# Altium project drone_base.PrjPcb
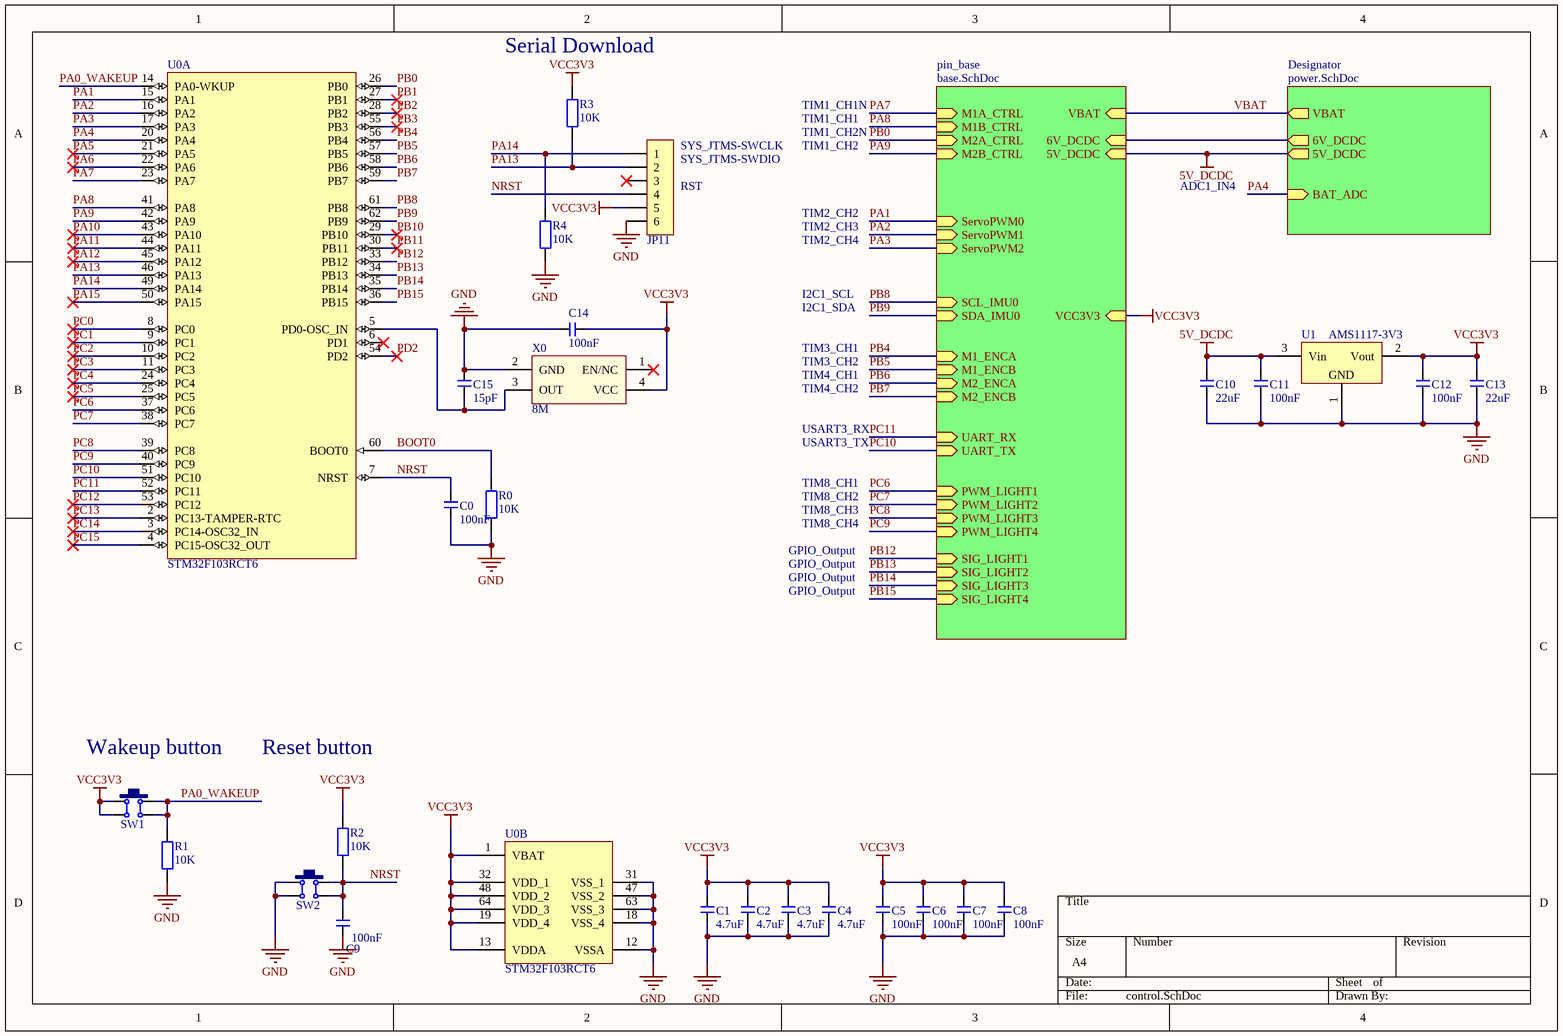
[diagram p0: control.SchDoc]
3 sheets, 91 parts. Net scope: hierarchical (ports join the sheet entries above them; power ports are global).
Board file: PCB.PcbDoc
Sheets:
  control.SchDoc
    pin_base = base.SchDoc
    Designator = power.SchDoc

## Sheet control.SchDoc
size A4; SheetNumber: 1; SheetTotal: 3

### Parts
C0  100nF  [C 0402_M]
C1  4.7uF  [C 0603_M]
C2  4.7uF  [C 0603_M]
C3  4.7uF  [C 0603_M]
C4  4.7uF  [C 0603_M]
C5  100nF  [C 0402_M]
C6  100nF  [C 0402_M]
C7  100nF  [C 0402_M]
C8  100nF  [C 0402_M]
C9  100nF  [C 0402_M]
C10  22uF  [C 1206_M]
C11  100nF  [C 0402_M]
C12  100nF  [C 0402_M]
C13  22uF  [C 1206_M]
C14  100nF  [C 0402_M]
C15  15pF  [C 0402_M]
JP11  HDR-1X6  [HDR2.54-WI-6P]  (value not drawn)
R0  10K  [R 0402_M]
R1  10K  [R 0402_M]
R2  10K  [R 0402_M]
R3  10K  [R 0402_M]
R4  10K  [R 0402_M]
SW1  6x6x5  [TSW SMD-6*6*4.3]  (value not drawn)
SW2  6x6x5  [TSW SMD-6*6*4.3]  (value not drawn)
U0  STM32F103RCT6  [LQFP64_M]  (parts A,B of 2)
U1  AMS1117-3V3  [SOT223_L]
X0  8M  [OSC 3225-4P]

### Sub-sheets
Designator = power.SchDoc: VBAT (out), 6V_DCDC (out), 5V_DCDC (out), BAT_ADC (in)
pin_base = base.SchDoc: M2B_CTRL (in), M2A_CTRL (in), M1B_CTRL (in), M1A_CTRL (in), VBAT (in), ServoPWM0 (in), ServoPWM1 (in), ServoPWM2 (in), SCL_IMU0 (in), SDA_IMU0 (in), M1_ENCB (in), M1_ENCA (in), M2_ENCA (in), M2_ENCB (in), 6V_DCDC (in), VCC3V3 (in), 5V_DCDC (in), UART_RX (in), UART_TX (in), PWM_LIGHT1 (in), PWM_LIGHT2 (in), PWM_LIGHT3 (in), PWM_LIGHT4 (in), SIG_LIGHT1 (in), SIG_LIGHT2 (in), SIG_LIGHT3 (in), SIG_LIGHT4 (in)

### Nets
5V_DCDC: C10.2 C11.2 U1.3(Vin) ; sheet pin_base/5V_DCDC, sheet Designator/5V_DCDC
6V_DCDC: sheet pin_base/6V_DCDC, sheet Designator/6V_DCDC
GND: C0.1 C1.1 C2.1 C3.1 C4.1 C5.1 C6.1 C7.1 C8.1 C9.1 C10.1 C11.1 C12.1 C13.1 C14.2 C15.1 JP11.6 R0.1 R1.1 R4.1 SW2.1 SW2.4 U0.12(VSSA) U0.18(VSS_4) U0.31(VSS_1) U0.47(VSS_2) U0.63(VSS_3) U1.1(GND) X0.2(GND)
VBAT: sheet pin_base/VBAT, sheet Designator/VBAT
VCC3V3: C1.2 C2.2 C3.2 C4.2 C5.2 C6.2 C7.2 C8.2 C12.2 C13.2 C14.1 JP11.5 R2.2 R3.2 SW1.1 SW1.4 U0.1(VBAT) U0.13(VDDA) U0.19(VDD_4) U0.32(VDD_1) U0.48(VDD_2) U0.64(VDD_3) U1.2(Vout) X0.4(VCC) ; sheet pin_base/VCC3V3
BOOT0: R0.2 U0.60(BOOT0)
NRST: C0.2 C9.2 JP11.4 R2.1 SW2.2 SW2.3 U0.7(NRST)
PA0_WAKEUP: R1.2 SW1.2 SW1.3 U0.14(PA0-WKUP)
PA1: U0.15(PA1) ; sheet pin_base/ServoPWM0
PA2: U0.16(PA2) ; sheet pin_base/ServoPWM1
PA3: U0.17(PA3) ; sheet pin_base/ServoPWM2
PA4: U0.20(PA4) ; sheet Designator/BAT_ADC
PA5: U0.21(PA5)
PA6: U0.22(PA6)
PA7: U0.23(PA7) ; sheet pin_base/M1A_CTRL  [project net M1B_CTRL]
PA8: U0.41(PA8) ; sheet pin_base/M1B_CTRL  [project net M1A_CTRL]
PA9: U0.42(PA9) ; sheet pin_base/M2B_CTRL  [project net M2B_CTRL]
PA10: U0.43(PA10)
PA11: U0.44(PA11)
PA12: U0.45(PA12)
PA13: JP11.2 R3.1 U0.46(PA13)
PA14: JP11.1 R4.2 U0.49(PA14)
PA15: U0.50(PA15)
PB0: U0.26(PB0) ; sheet pin_base/M2A_CTRL  [project net M2A_CTRL]
PB1: U0.27(PB1)
PB2: U0.28(PB2)
PB3: U0.55(PB3)
PB4: U0.56(PB4) ; sheet pin_base/M1_ENCA
PB5: U0.57(PB5) ; sheet pin_base/M1_ENCB
PB6: U0.58(PB6) ; sheet pin_base/M2_ENCA
PB7: U0.59(PB7) ; sheet pin_base/M2_ENCB
PB8: U0.61(PB8) ; sheet pin_base/SCL_IMU0
PB9: U0.62(PB9) ; sheet pin_base/SDA_IMU0
PB10: U0.29(PB10)
PB11: U0.30(PB11)
PB12: U0.33(PB12) ; sheet pin_base/SIG_LIGHT1
PB13: U0.34(PB13) ; sheet pin_base/SIG_LIGHT2
PB14: U0.35(PB14) ; sheet pin_base/SIG_LIGHT3
PB15: U0.36(PB15) ; sheet pin_base/SIG_LIGHT4
PC0: U0.8(PC0)
PC1: U0.9(PC1)
PC2: U0.10(PC2)
PC3: U0.11(PC3)
PC4: U0.24(PC4)
PC5: U0.25(PC5)
PC6: U0.37(PC6) ; sheet pin_base/PWM_LIGHT1
PC7: U0.38(PC7) ; sheet pin_base/PWM_LIGHT2
PC8: U0.39(PC8) ; sheet pin_base/PWM_LIGHT3
PC9: U0.40(PC9) ; sheet pin_base/PWM_LIGHT4
PC10: U0.51(PC10) ; sheet pin_base/UART_TX
PC11: U0.52(PC11) ; sheet pin_base/UART_RX
PC12: U0.53(PC12)
PC13: U0.2(PC13-TAMPER-RTC)
PC14: U0.3(PC14-OSC32_IN)
PC15: U0.4(PC15-OSC32_OUT)
PD2: U0.54(PD2)
NetC15_2: C15.2 U0.5(PD0-OSC_IN) X0.3(OUT)

Not connected (* = marked no-connect by the designer): JP11 3*; U0 6(PD1)*; X0 1(EN/NC)*

### Notes on the sheet
- (near R3) Serial Download
- TIM1_CH1N
- (near JP11) SYS_JTMS-SWDIO
- (near JP11) SYS_JTMS-SWCLK
- TIM1_CH1
- TIM1_CH2N
- TIM1_CH2
- (near JP11) RST
- TIM2_CH2
- TIM2_CH3
- TIM2_CH4
- ADC1_IN4
- I2C1_SCL
- I2C1_SDA
- TIM3_CH1
- TIM3_CH2
- TIM4_CH1
- TIM4_CH2
- USART3_RX
- USART3_TX
- TIM8_CH1
- TIM8_CH2
- TIM8_CH3
- GPIO_Output
- TIM8_CH4
- (near SW1) Wakeup button
- Reset button

### Library data of the parts
C0-C15 = C: 贴片电容
JP11 = Header 6: 6P接插件; 版权归属: 封装库来自淘宝 ID：黄晶宝石; BOM名称: 6P接插件; 学习资源: https://shop463601444.taobao.com
R0-R4 = R: 贴片电阻
SW1 SW2 = TSW SMD-6x6: 贴片6x6轻触开关
U0 = STM32F103RCT6: STM32 ARM-based 32-bit MCU Performance Line with 256 kB Flash, 48 kB Internal RAM, -40 to +85癈 Temperature, 64-Pin LQFP, Tray; DatasheetVersion: rev8.0, Apr-2011; PackageVersion: rev13, Apr-2011; PackageReference: LQFP64; PackageDescription: 64-Pin Low-Profile Quad Flat Pack, 10 x 10 mm Body, 0.5 mm Pitch (LQFP64); ComponentLink1Description: Manufacturer URL; ComponentLink1URL: http://www.st.com/; ComponentLink2Description: STM32F103 Datasheet; ComponentLink2URL: http://www.st.com/internet/com/TECHNICAL_RESOURCES/TECHNICAL_LITERATURE/DATASHEET/CD00191185.pdf; ComponentLink3Description: STM32 Family Web Page; ComponentLink3URL: www.st.com/stm32
U1 = AMS1117: 三端稳压芯片; BOM名称: 稳压芯片; 淘宝ID: 封装库来自淘宝 ID：黄晶宝石; 欢迎光临淘宝店铺: https://shop463601444.taobao.com
X0 = XTAL-ACT-4P: 4脚有源晶振

## Sheet base.SchDoc
size A4; SheetNumber: 2; SheetTotal: 3
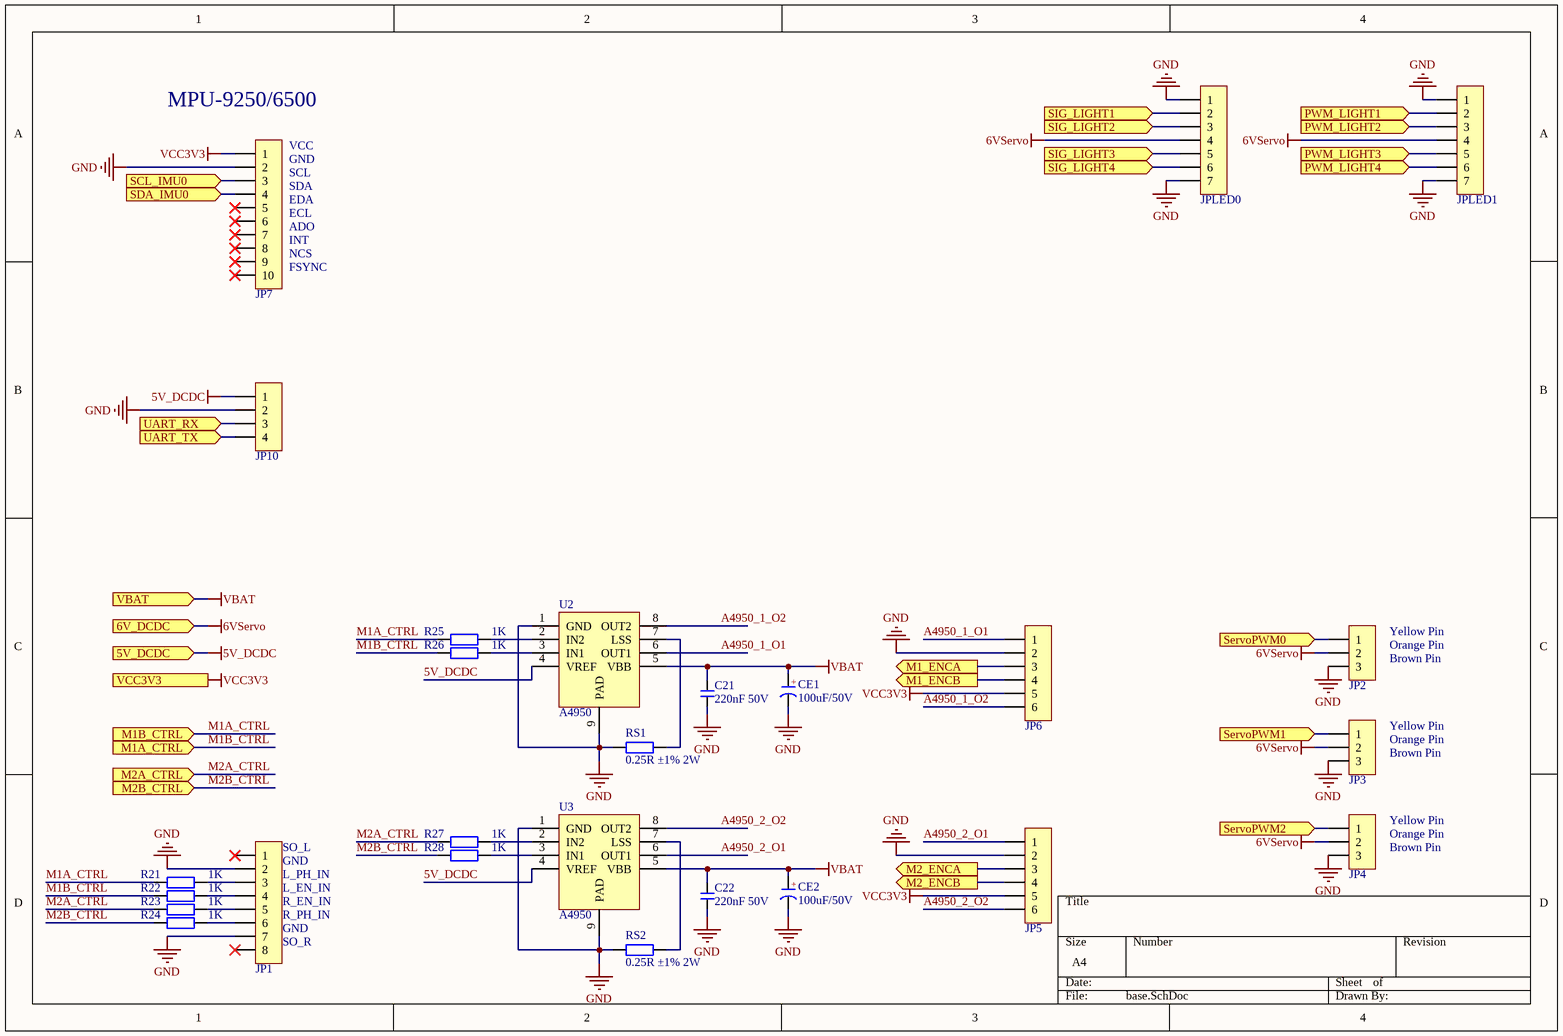
[diagram p1: base.SchDoc]

### Parts
C21  220nF 50V  [C 0603_M]
C22  220nF 50V  [C 0603_M]
CE1  100uF/50V  [CM E(8*10.2)]
CE2  100uF/50V  [CM E(8*10.2)]
JP1  HDR-1X8  [MX 1.25-LI-8P]  (value not drawn)
JP2  HDR-1X3  [HDR2.54-LI-3P]  (value not drawn)
JP3  HDR-1X3  [HDR2.54-LI-3P]  (value not drawn)
JP4  HDR-1X3  [HDR2.54-LI-3P]  (value not drawn)
JP5  HDR-1X6  [XH2.54-LI-6P]  (value not drawn)
JP6  HDR-1X6  [XH2.54-LI-6P]  (value not drawn)
JP7  HDR-1X10  [HDR2.54-M-LI-10P]  (value not drawn)
JP10  HDR-1X4  [HDR2.54-LI-4P]  (value not drawn)
JPLED0  HDR-1X7  [XH2.54-LI-7P]  (value not drawn)
JPLED1  HDR-1X7  [XH2.54-LI-7P]  (value not drawn)
R21  1K  [R 0402_M]
R22  1K  [R 0402_M]
R23  1K  [R 0402_M]
R24  1K  [R 0402_M]
R25  1K  [R 0402_M]
R26  1K  [R 0402_M]
R27  1K  [R 0402_M]
R28  1K  [R 0402_M]
RS1  0.25R ±1% 2W  [R 2512_M]
RS2  0.25R ±1% 2W  [R 2512_M]
U2  A4950  [A4950]
U3  A4950  [A4950]

### Ports
5V_DCDC (in), 6V_DCDC (in), M1_ENCA (out), M1_ENCB (out), M1A_CTRL (in), M1B_CTRL (in), M2_ENCA (out), M2_ENCB (out), M2A_CTRL (in), M2B_CTRL (in), PWM_LIGHT1 (in), PWM_LIGHT2 (in), PWM_LIGHT3 (in), PWM_LIGHT4 (in), SCL_IMU0 (in), SDA_IMU0 (in), ServoPWM0 (in), ServoPWM1 (in), ServoPWM2 (in), SIG_LIGHT1 (in), SIG_LIGHT2 (in), SIG_LIGHT3 (in), SIG_LIGHT4 (in), UART_RX (in), UART_TX (in), VBAT (in), VCC3V3 (in)

### Nets
5V_DCDC: JP10.1 U2.4(VREF) U3.4(VREF) ; port 5V_DCDC
6VServo: JP2.2 JP3.2 JP4.2 JPLED0.4 JPLED1.4 ; port 6V_DCDC  [project net 6V_DCDC]
GND: C21.1 C22.1 CE1.2(K) CE2.2(K) JP1.2 JP1.7 JP2.3 JP3.3 JP4.3 JP5.2 JP6.2 JP7.2 JP10.2 JPLED0.1 JPLED0.7 JPLED1.1 JPLED1.7 RS1.1 RS2.1 U2.1(GND) U2.9(PAD) U3.1(GND) U3.9(PAD)
VBAT: C21.2 C22.2 CE1.1(A) CE2.1(A) U2.5(VBB) U3.5(VBB) ; port VBAT
VCC3V3: JP5.5 JP6.5 JP7.1 ; port VCC3V3
A4950_1_O1: JP6.1 U2.6(OUT1)
A4950_1_O2: JP6.6 U2.8(OUT2)
A4950_2_O1: JP5.1 U3.6(OUT1)
A4950_2_O2: JP5.6 U3.8(OUT2)
M1A_CTRL: R21.1 R25.1 ; port M1B_CTRL
M1B_CTRL: R22.1 R26.1 ; port M1A_CTRL
M2A_CTRL: R23.1 R27.1 ; port M2A_CTRL
M2B_CTRL: R24.1 R28.1 ; port M2B_CTRL
PA1: JP2.1 ; port ServoPWM0
PA2: JP3.1 ; port ServoPWM1
PA3: JP4.1 ; port ServoPWM2
PB4: JP6.3 ; port M1_ENCA
PB5: JP6.4 ; port M1_ENCB
PB6: JP5.3 ; port M2_ENCA
PB7: JP5.4 ; port M2_ENCB
PB8: JP7.3 ; port SCL_IMU0
PB9: JP7.4 ; port SDA_IMU0
PB12: JPLED0.2 ; port SIG_LIGHT1
PB13: JPLED0.3 ; port SIG_LIGHT2
PB14: JPLED0.5 ; port SIG_LIGHT3
PB15: JPLED0.6 ; port SIG_LIGHT4
PC6: JPLED1.2 ; port PWM_LIGHT1
PC7: JPLED1.3 ; port PWM_LIGHT2
PC8: JPLED1.5 ; port PWM_LIGHT3
PC9: JPLED1.6 ; port PWM_LIGHT4
PC10: JP10.4 ; port UART_TX
PC11: JP10.3 ; port UART_RX
NetJP1_3: JP1.3 R21.2
NetJP1_4: JP1.4 R22.2
NetJP1_5: JP1.5 R23.2
NetJP1_6: JP1.6 R24.2
NetR25_2: R25.2 U2.2(IN2)
NetR26_2: R26.2 U2.3(IN1)
NetR27_2: R27.2 U3.2(IN2)
NetR28_2: R28.2 U3.3(IN1)
NetRS1_2: RS1.2 U2.7(LSS)
NetRS2_2: RS2.2 U3.7(LSS)

Not connected (* = marked no-connect by the designer): JP1 1* 8*; JP7 5* 6* 7* 8* 9* 10*

### Notes on the sheet
- (near JP7) MPU-9250/6500
- (near JP7) VCC
- (near JP7) GND
- (near JP7) SCL
- (near JP7) SDA
- (near JP7) EDA
- (near JP7) ECL
- (near JP7) ADO
- (near JP7) INT
- (near JP7) NCS
- (near JP7) FSYNC
- (near JP2) Yellow Pin
- (near JP2) Orange Pin
- (near JP2) Brown Pin
- (near JP3) Yellow Pin
- (near JP3) Orange Pin
- (near JP3) Brown Pin
- (near JP1) SO_L
- (near JP4) Yellow Pin
- (near JP4) Orange Pin
- (near JP4) Brown Pin
- (near JP1) GND
- (near JP1) L_PH_IN
- (near JP1) L_EN_IN
- (near JP1) R_EN_IN
- (near JP1) R_PH_IN
- (near JP1) SO_R
- (in symbol CE_SMD) +

### Library data of the parts
C21 C22 = C: 贴片电容
CE1 CE2 = CE_SMD: 贴片电解电容
JP1 = Header 8_1.25: 8P接插件
JP2-JP4 = Header 3: 3P接插件
JP5 JP6 = Header 6: 6P接插件; 版权归属: 封装库来自淘宝 ID：黄晶宝石; BOM名称: 6P接插件; 学习资源: https://shop463601444.taobao.com
JP7 = Header 10: 10P接插件
JP10 = Header 4: 4P接插件; 版权归属: 封装库来自淘宝 ID：黄晶宝石; BOM名称: 4P接插件; 学习资源: https://shop463601444.taobao.com
JPLED0 = Header 7: 7P接插件; 版权归属: 封装库来自淘宝 ID：黄晶宝石; BOM名称: 7P接插件; 学习资源: https://shop463601444.taobao.com
JPLED1 = Header 7: 7P接插件
R21-R28 RS1 RS2 = R: 贴片电阻
U2 U3 = A4950: Full-Bridge DMOS PWM Motor Driver

## Sheet power.SchDoc
size A4; SheetNumber: 3; SheetTotal: 3
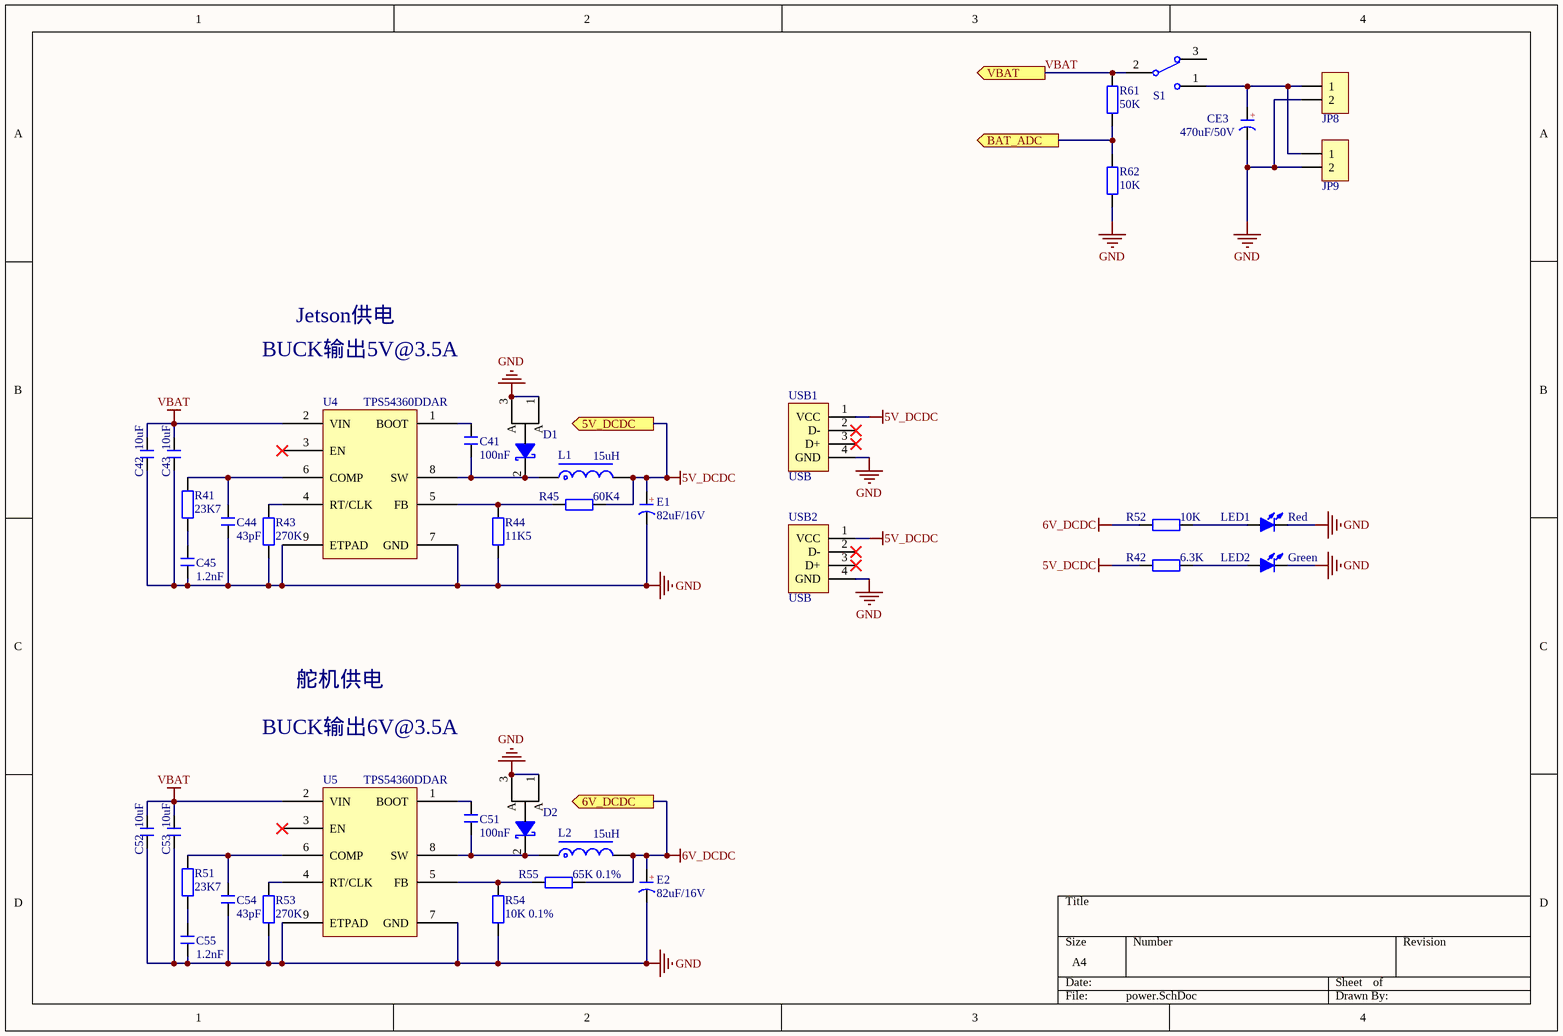
[diagram p2: power.SchDoc]

### Parts
C41  100nF  [C 0402_M]
C42  10uF  [C 2220_M]
C43  10uF  [C 2220_M]
C44  43pF  [C 0402_M]
C45  1.2nF  [C 0402_M]
C51  100nF  [C 0402_M]
C52  10uF  [C 2220_M]
C53  10uF  [C 2220_M]
C54  43pF  [C 0402_M]
C55  1.2nF  [C 0402_M]
CE3  470uF/50V  [CAP 5.0*10*16]
D1  50WQ10FNPBF  [D-PAK]  (value not drawn)
D2  50WQ10FNPBF  [D-PAK]  (value not drawn)
E1  82uF/16V  [CM C(5*5.4)]
E2  82uF/16V  [CM C(5*5.4)]
JP8  HDR-1X2  [TX60-LI-S]  (value not drawn)
JP9  HDR-1X2  [TX60-LI-S]  (value not drawn)
L1  15uH  [CDRH127]
L2  15uH  [CDRH127]
LED1  Red  [LED 1206R]
LED2  Green  [LED 1206G]
R41  23K7  [R 0402_M]
R42  6.3K  [R 0603_M]
R43  270K  [R 0603_M]
R44  11K5  [R 0603_M]
R45  60K4  [R 0402_M]
R51  23K7  [R 0402_M]
R52  10K  [R 0402_M]
R53  270K  [R 0603_M]
R54  10K 0.1%  [R 0603_M]
R55  65K 0.1%  [R 0402_M]
R61  50K  [R 0402_M]
R62  10K  [R 0402_M]
S1  SW-SPDT  [SS12D10]  (value not drawn)
U4  TPS54360DDAR  [SOP127P600X170_HS-9N]
U5  TPS54360DDAR  [SOP127P600X170_HS-9N]
USB1  USB  [USB-A/S_B]
USB2  USB  [USB-A/S_B]

### Ports
5V_DCDC (out), 6V_DCDC (out), BAT_ADC (out), VBAT (out)

### Nets
5V_DCDC: E1.1(A) L1.2 R42.1 R45.2 USB1.1(VCC) USB2.1(VCC) ; port 5V_DCDC
6V_DCDC: E2.1(A) L2.2 R52.1 R55.2 ; port 6V_DCDC
GND: C42.1 C43.1 C44.1 C45.1 C52.1 C53.1 C54.1 C55.1 CE3.2(K) D1.1(A) D1.3(A) D2.1(A) D2.3(A) E1.2(K) E2.2(K) JP8.2 JP9.2 LED1.2(K) LED2.2(K) R43.1 R44.2 R53.1 R54.2 R62.1 U4.7(GND) U4.9(ETPAD) U5.7(GND) U5.9(ETPAD) USB1.4(GND) USB2.4(GND)
VBAT: C42.2 C43.2 C52.2 C53.2 R61.2 S1.2 U4.2(VIN) U5.2(VIN) ; port VBAT
PA4: R61.1 R62.2 ; port BAT_ADC
NetC41_1: C41.1 D1.2(K) L1.1 U4.8(SW)
NetC41_2: C41.2 U4.1(BOOT)
NetC44_2: C44.2 R41.2 U4.6(COMP)
NetC45_2: C45.2 R41.1
NetC51_1: C51.1 D2.2(K) L2.1 U5.8(SW)
NetC51_2: C51.2 U5.1(BOOT)
NetC54_2: C54.2 R51.2 U5.6(COMP)
NetC55_2: C55.2 R51.1
NetCE3_1: CE3.1(A) JP8.1 JP9.1 S1.1
NetLED1_1: LED1.1(A) R52.2
NetLED2_1: LED2.1(A) R42.2
NetR43_2: R43.2 U4.4(RT/CLK)
NetR44_1: R44.1 R45.1 U4.5(FB)
NetR53_2: R53.2 U5.4(RT/CLK)
NetR54_1: R54.1 R55.1 U5.5(FB)

Not connected (* = marked no-connect by the designer): S1 3; U4 3(EN)*; U5 3(EN)*; USB1 2(D-)* 3(D+)*; USB2 2(D-)* 3(D+)*

### Notes on the sheet
- BUCK输出5V@3.5A
- Jetson供电
- 舵机供电
- BUCK输出6V@3.5A
- (in symbol CE) +
- (in symbol CE_SMD_82uF_16V) +

### Library data of the parts
C41 C51 = C_100nF_0402: MuRata GRM155R71C104KA88D Cap: 100 nF  Total Derated Cap: 74 nF  VDC: 16 V  ESR: 1 mΩ  Package: 0402
C42 C43 C52 C53 = C_10uF_100V_2220: TDK C5750X7S2A106M230KB Cap: 10 µF  Total Derated Cap: 6.4 µF  VDC: 100 V  ESR: 5 mΩ  Package:
C44 C54 = C_43pF_0402: MuRata GRM1555C1H430JA01D Cap: 43 pF  Total Derated Cap: 43 pF  VDC: 50 V  ESR: 1 mΩ  Package: 0402
C45 C55 = C_1.2nF_0402: MuRata GRM155R71H122KA01D Cap: 1.2 nF  Total Derated Cap: 1.2 nF  VDC: 50 V  ESR: 1 mΩ  Package: 0402
CE3 = CE: 直插电解电容
D1 D2 = Diode Schottky_100V_5.5A: Vishay-Semiconductor 50WQ10FNPBF Type: Schottky  VRRM: 100 V  Io: 5.5 A; Imax: 500mA; Published: 8-Jun-2000; Revision: July-2002: Re-released for DXP Platform.; Publisher: Altium Limited; Price(RMB): 0.000
E1 E2 = CE_SMD_82uF_16V: Panasonic 16SVPF82M Cap: 82 µF  Total Derated Cap: 82 µF  VDC: 16 V  ESR: 27 mΩ  Package: 5x5.9
JP8 JP9 = Header 2: 2P接插件
L1 L2 = L-CDRH_15uH_5.65A: 功率屏蔽电感Sumida CDRH127/LDNP-150MC L: 15 µH  DCR: 26.4 mΩ  IDC: 5.65 A; BOM名称: 功率屏蔽电感; 版权归属: 封装库来自淘宝 ID：黄晶宝石; 联系售后: https://shop463601444.taobao.com
LED1 LED2 = LED-SMD: 贴片LED; 版权归属: 封装库来自淘宝 ID：黄晶宝石; BOM名称: 贴片LED; 学习资源: https://shop463601444.taobao.com
R41 R51 = R_23K7_0402_1%: Yageo AC0402FR-0723K7L Resistance: 23.7 kΩ  Tolerance: 1.0%  Power: 63 mW
R42 R52 R61 R62 = R_10K_0603: 贴片电阻
R43 R53 = R_270K_0603_1%: Yageo RC0603FR-07270KL Resistance: 270 kΩ  Tolerance: 1.0%  Power: 100 mW
R44 = R_11K5_0603_1%: Yageo RC0603FR-0711K5L Resistance: 11.5 kΩ  Tolerance: 1.0%  Power: 100 mW
R45 = R_60K4_0402_1%: Vishay-Dale CRCW040260K4FKED Resistance: 60.4 kΩ Tolerance: 1.0%  Power: 63 mW
R54 R55 = R: 贴片电阻
S1 = SW-SPDT: 单刀双掷开关 3脚船型、钮子、拨动开关 SPDT Subminiature Toggle Switch; Published: 24-Mar-1999; Publisher: Altium Limited; Price(RMB): 0.000
USB1 USB2 = USB-A/S: USB-A型母接口

## Nets that join several sheets
5V_DCDC: control (C10.2 C11.2 U1.3), base (JP10.1 U2.4 U3.4), power (6 pins)
6V_DCDC: base (5 pins), power (E2.1 L2.2 R52.1 R55.2)
GND: control (29 pins), base (23 pins), power (30 pins)
VBAT: base (6 pins), power (8 pins)
VCC3V3: control (24 pins), base (JP5.5 JP6.5 JP7.1)
M1A_CTRL: control (U0.41), base (R21.1 R25.1)
M1B_CTRL: control (U0.23), base (R22.1 R26.1)
M2A_CTRL: control (U0.26), base (R23.1 R27.1)
M2B_CTRL: control (U0.42), base (R24.1 R28.1)
PA1: control (U0.15), base (JP2.1)
PA2: control (U0.16), base (JP3.1)
PA3: control (U0.17), base (JP4.1)
PA4: control (U0.20), power (R61.1 R62.2)
PB4: control (U0.56), base (JP6.3)
PB5: control (U0.57), base (JP6.4)
PB6: control (U0.58), base (JP5.3)
PB7: control (U0.59), base (JP5.4)
PB8: control (U0.61), base (JP7.3)
PB9: control (U0.62), base (JP7.4)
PB12: control (U0.33), base (JPLED0.2)
PB13: control (U0.34), base (JPLED0.3)
PB14: control (U0.35), base (JPLED0.5)
PB15: control (U0.36), base (JPLED0.6)
PC6: control (U0.37), base (JPLED1.2)
PC7: control (U0.38), base (JPLED1.3)
PC8: control (U0.39), base (JPLED1.5)
PC9: control (U0.40), base (JPLED1.6)
PC10: control (U0.51), base (JP10.4)
PC11: control (U0.52), base (JP10.3)